# Altium schematic sheet Humidifier.SchDoc
size A2
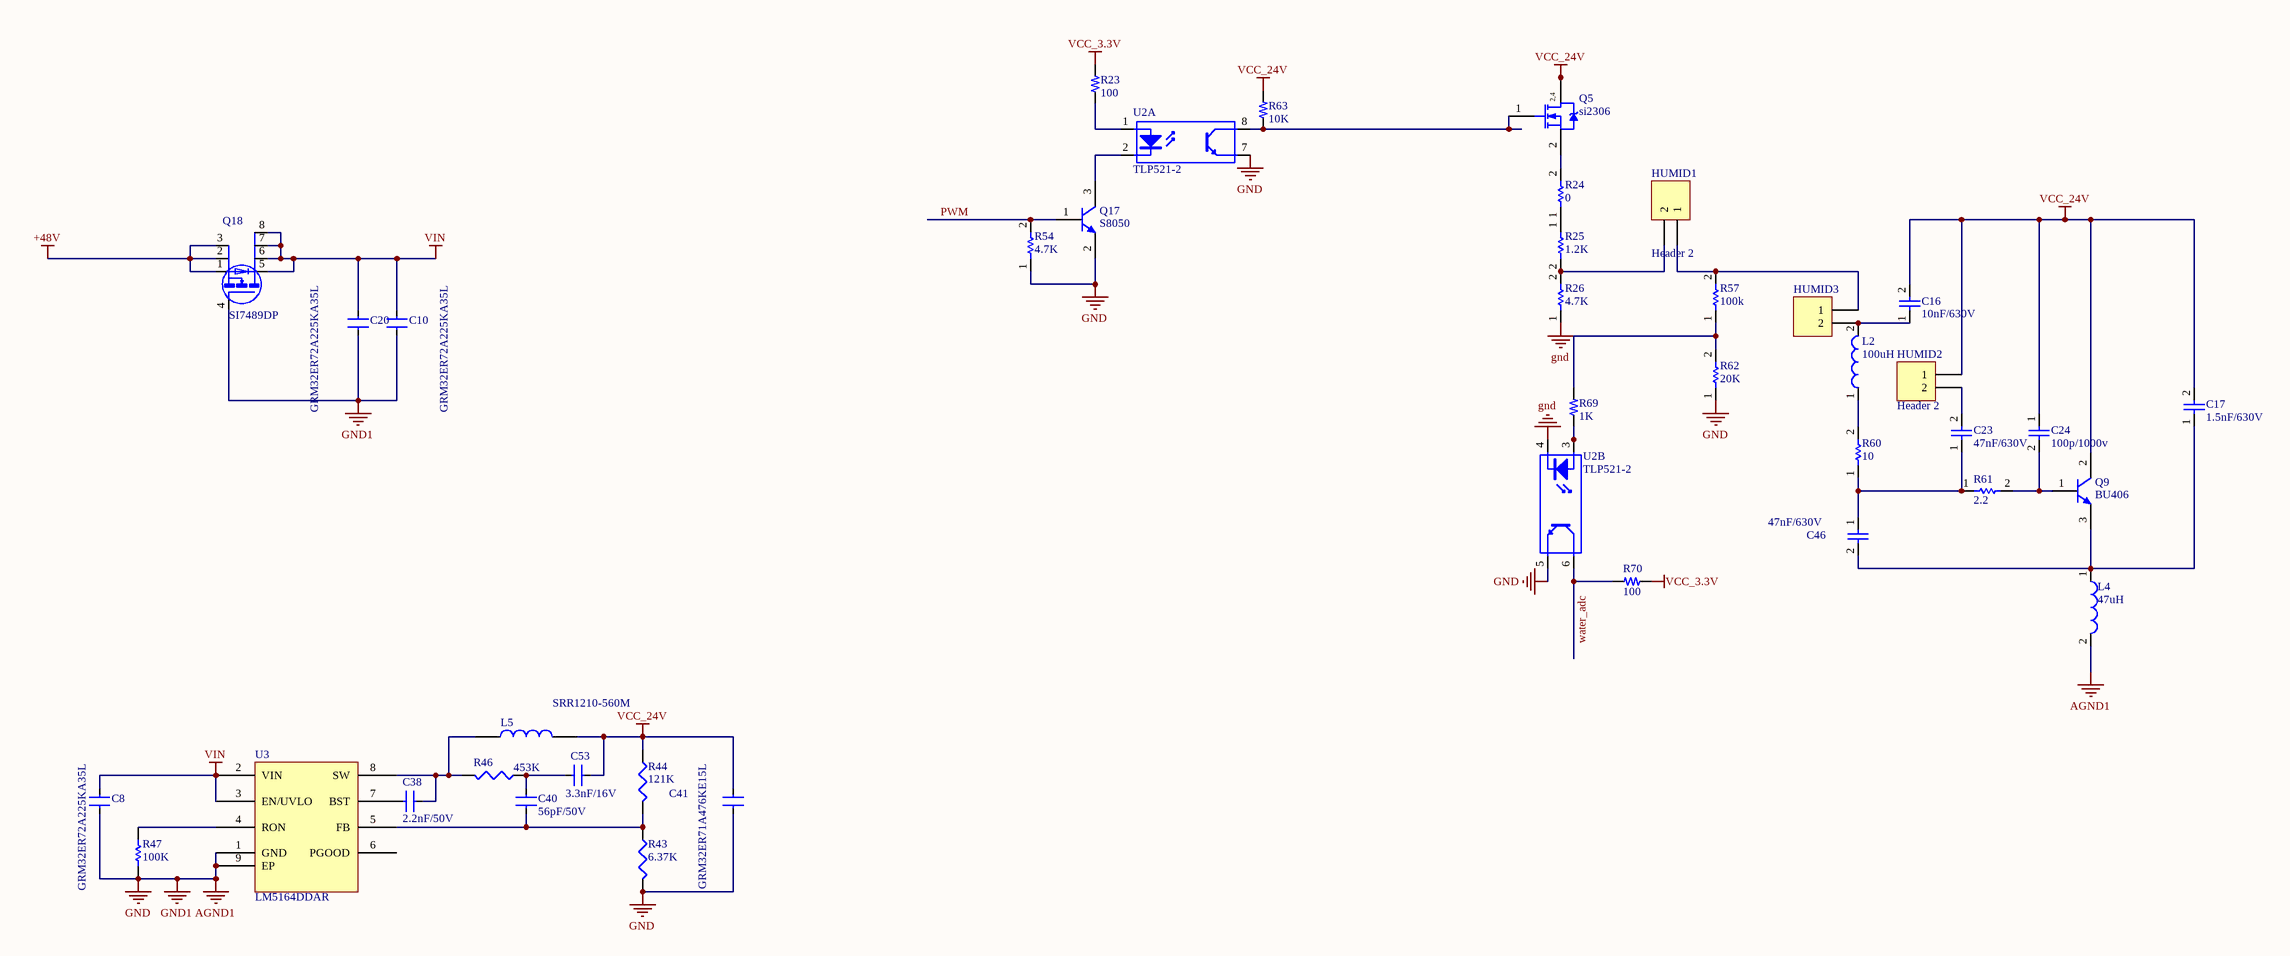
[diagram p0: Humidifier.SchDoc]

## Parts
C8  GRM32ER72A225KA35L  [1210C]
C10  GRM32ER72A225KA35L  [1210C]
C16  10nF/630V  [CAP_5MM]
C17  1.5nF/630V  [AXIAL-0.3]
C20  GRM32ER72A225KA35L  [1210C]
C23  47nF/630V  [AXIAL-0.4]
C24  100p/1000v  [CAP_5MM]
C38  2.2nF/50V  [0603C]
C40  56pF/50V  [0603C]
C41  GRM32ER71A476KE15L  [1210C]
C46  47nF/630V  [AXIAL-0.4]
C53  3.3nF/16V  [0603C]
HUMID1  Header 2  [SIP-2L]
HUMID2  Header 2  [SIP-2L]
HUMID3  (no value)  [SIP-2L]
L2  100uH  [AXIAL-0.5]
L4  47uH  [6*8]
L5  SRR1210-560M  [SRR1210]
Q5  si2306  [SOT23-3]
Q9  BU406  [to220]
Q17  S8050  [SOT23-3]
Q18  SI7489DP  [PowerPAK SO-8]
R23  100  [0603R]
R24  0  [AXIAL-0.4]
R25  1.2K  [AXIAL-0.4]
R26  4.7K  [AXIAL-0.4]
R43  6.37K  [0603R]
R44  121K  [0603R]
R46  453K  [0603R]
R47  100K  [0603R]
R54  4.7K  [0603r]
R57  100k  [0603r]
R60  10  [AXIAL-0.4]
R61  2.2  [AXIAL-0.4]
R62  20K  [0603r]
R63  10K  [0603R]
R69  1K  [0603R]
R70  100  [0603R]
U2  TLP521-2  [TLP521-2GB]  (parts A,B of 2)
U3  LM5164DDAR  [SOP127P600X168_HS-8N]

## Nets
+48V: Q18.1(S) Q18.2(S) Q18.3(S)
AGND1: C8.2 C10.2 C20.2 C41.2 L4.2 Q17.2(E) Q18.4(G) R26.1 R43.2 R47.1 R54.1 R62.1 U2.4(K) U2.5(E) U2.7(E) U3.1(GND) U3.9(EP)  [also labelled gnd, GND1]
VCC_3.3V: R23.2 R70.2
VCC_24V: C16.2 C17.2 C24.1 C41.1 C53.2 HUMID2.1 L5.2 Q5.3(D) Q9.2(C) R44.1 R63.2
VIN: C8.1 C10.1 C20.1 Q18.5(D) Q18.6(D) Q18.7(D) Q18.8(D) U3.2(VIN) U3.3(EN/UVLO)
PWM: Q17.1(B) R54.2
water_adc: R70.1 U2.6(C)
NetC16_1: C16.1 HUMID3.2 L2.2
NetC17_1: C17.1 C46.2 L4.1 Q9.3(E)
NetC23_1: C23.1 C46.1 R60.1 R61.1
NetC23_2: C23.2 HUMID2.2
NetC24_2: C24.2 Q9.1(B) R61.2
NetC38_1: C38.1 U3.7(BST)
NetC38_2: C38.2 L5.1 R46.2 U3.8(SW)
NetC40_1: C40.1 C53.1 R46.1
NetC40_2: C40.2 R43.1 R44.2 U3.5(FB)
NetHUMID1_1: HUMID1.1 HUMID3.1 R57.2
NetHUMID1_2: HUMID1.2 R25.2 R26.2
NetL2_1: L2.1 R60.2
NetQ5_1: Q5.1(G) R63.1 U2.8(C)
NetQ5_2: Q5.2(S) R24.2
NetQ17_3: Q17.3(C) U2.2(K)
NetR23_1: R23.1 U2.1(A)
NetR24_1: R24.1 R25.1
NetR47_2: R47.2 U3.4(RON)
NetR57_1: R57.1 R62.2 R69.2
NetR69_1: R69.1 U2.3(A)

Not connected (* = marked no-connect by the designer): U3 6(PGOOD)

## Notes on the sheet
- (in symbol BUK92150-55A) 2,4

## Library data of the parts
C8 C10 C20 C38 C40 C41 C53 = 0.01UF: CCX85-103
C16 C17 C23 C24 C46 = Cap: Capacitor; Value: 1nF/100V; Published: 8-Jun-2000; LatestRevisionDate: 17-Jul-2002; LatestRevisionNote: Re-released for DXP Platform.; PackageReference: RAD-0.3; Publisher: Altium Limited
HUMID1-HUMID3 = Header 2: Header, 2-Pin; LatestRevisionDate: 17-Jul-2002; LatestRevisionNote: Re-released for DXP Platform.; Publisher: Altium Limited
L2 L4 = Inductor: Code_IEC: 1005; Value: 10uH; Published: 8-Jun-2000; LatestRevisionDate: 29-May-2009; LatestRevisionNote: IPC-7351 Footprint Added.; PackageReference: 0402-A; Publisher: Altium Limited; PackageDescription: Chip Inductor; Code_JEITA: 0402
L5 = INDUCTOR
Q5 = BUK92150-55A: Published: 8-Jun-2000; LatestRevisionDate: 17-Jul-2002; LatestRevisionNote: Re-released for DXP Platform.; DatasheetVersion: 6-Oct-1997; PackageVersion: Aug-1998; PackageReference: TSOP-6; Publisher: Altium Limited; PackageDescription: SOT-457/SC-74; 6 Leads; Body 3.1 x 3 mm, inc. leads (LxW max); ComponentLink1Description: Manufacturer Link; ComponentLink1URL: http://www.vishay.com/; ComponentLink2Description: Datasheet; ComponentLink2URL: http://www.vishay.com/docs/70192/70192.pdf
Q9 = NPN: NPN Bipolar Transistor; Published: 8-Jun-2000; LatestRevisionDate: 17-Jul-2002; LatestRevisionNote: Re-released for DXP Platform.; PackageReference: TO-226; Publisher: Altium Limited; Code_JEDEC: TO-226-AA
Q17 = NPN
Q18 = Si4004DY
R23 R63 R69 R70 = R
R24-R26 R47 R54 R57 R60-R62 = Res Semi: Semiconductor Resistor; Value: 1K; Published: 8-Jun-2000; LatestRevisionDate: 17-Jul-2002; LatestRevisionNote: Re-released for DXP Platform.; PackageReference: AXIAL-0.5; Publisher: Altium Limited
R43 R44 R46 = Res3: Resistor; Published: 8-Jun-2000; LatestRevisionDate: 29-May-2009; LatestRevisionNote: IPC-7351 Footprint Added.; PackageReference: J1-0603; Publisher: Altium Limited; PackageDescription: Chip Resistor